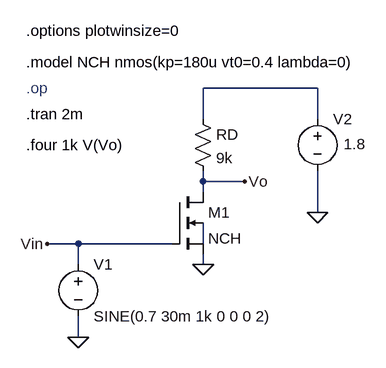
[diagram p0: schematic Small Signal Condition and THD.asc]
Small Signal Condition and THD.asc, the LTspice schematic file:
Version 4
SHEET 1 880 680
WIRE 352 32 176 32
WIRE 176 80 176 32
WIRE 352 80 352 32
WIRE 176 176 176 160
WIRE 240 176 176 176
WIRE 176 192 176 176
WIRE 352 224 352 160
WIRE -16 272 -64 272
WIRE 128 272 -16 272
WIRE 176 272 176 240
WIRE -16 304 -16 272
WIRE 176 304 176 288
WIRE -16 416 -16 384
FLAG 176 304 0
FLAG 352 224 0
FLAG -16 416 0
FLAG 240 176 Vo
FLAG -64 272 Vin
SYMBOL res 160 64 R0
SYMATTR InstName RD
SYMATTR Value 9k
SYMBOL nmos4 128 192 R0
SYMATTR InstName M1
SYMATTR Value NCH
SYMATTR Value2 l=1u w=12.35u
SYMBOL voltage -16 288 R0
WINDOW 123 0 0 Left 0
WINDOW 39 0 0 Left 0
SYMATTR InstName V1
SYMATTR Value SINE(0.7 30m 1k 0 0 0 2)
SYMBOL voltage 352 64 R0
WINDOW 3 40 54 Left 2
WINDOW 123 0 0 Left 0
WINDOW 39 0 0 Left 0
SYMATTR Value 1.8
SYMATTR InstName V2
TEXT -96 -8 Left 2 !.model NCH nmos(kp=180u vt0=0.4 lambda=0)
TEXT -96 32 Left 2 ;.op
TEXT -96 72 Left 2 !.tran 2m
TEXT -96 120 Left 2 !.four 1k V(Vo)
TEXT -96 -56 Left 2 !.options plotwinsize=0

The netlist it stands for:
* Small Signal Condition and THD.asc
RD N001 Vo 9k
M1 Vo Vin 0 N002 NCH l=1u w=12.35u
V1 Vin 0 SINE(0.7 30m 1k 0 0 0 2)
V2 N001 0 1.8
.model NMOS NMOS
.model PMOS PMOS
.lib standard.mos
.model NCH nmos(kp=180u vt0=0.4 lambda=0)
* .op
.tran 2m
.four 1k V(Vo)
.options plotwinsize=0
.backanno
.end